# Altium schematic sheet 10_Wifi.SchDoc
size A4
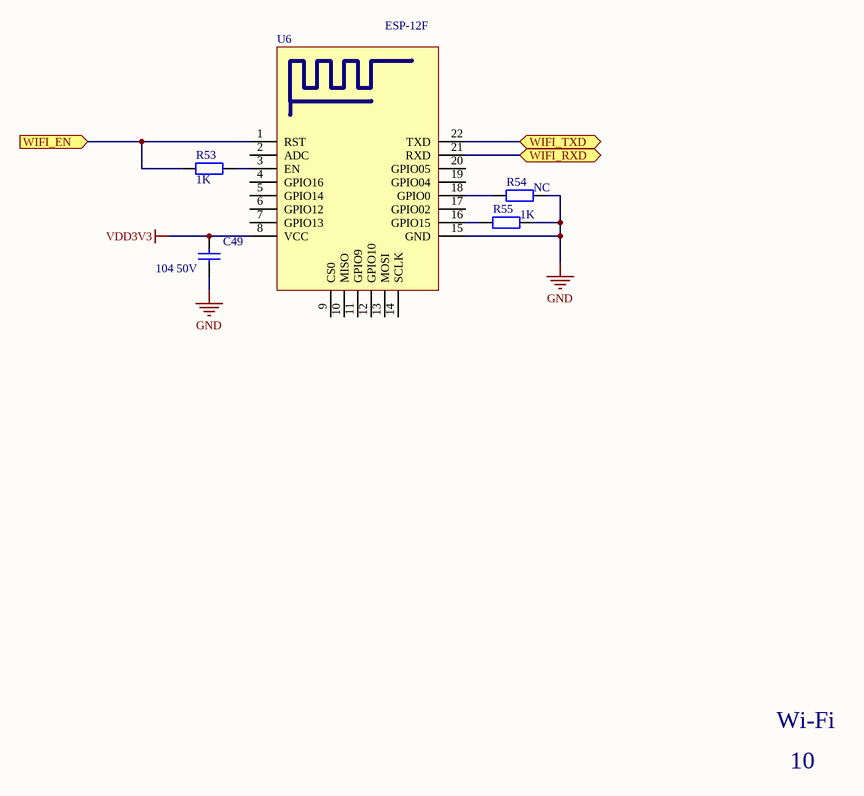
[diagram p0: 10_Wifi.SchDoc]

## Parts
C49  104 50V  [SMD-0603C]
R53  1K  [SMD-0603]
R54  NC  [SMD-0603]
R55  1K  [SMD-0603]
U6  ESP-12F  [ESP-12F]

## Ports
WIFI_EN (in), WIFI_RXD (bidir), WIFI_TXD (bidir)

## Nets
GND: C49.1 R54.1 R55.2 U6.15(GND)
VDD3V3: C49.2 U6.8(VCC)
WIFI_EN: R53.1 U6.1(RST) ; port WIFI_EN
WIFI_RXD: U6.21(RXD) ; port WIFI_RXD
WIFI_TXD: U6.22(TXD) ; port WIFI_TXD
NetR53_2: R53.2 U6.3(EN)
NetR54_2: R54.2 U6.18(GPIO0)
NetR55_1: R55.1 U6.16(GPIO15)

Not connected (* = marked no-connect by the designer): U6 2(ADC) 4(GPIO16) 5(GPIO14) 6(GPIO12) 7(GPIO13) 9(CS0) 10(MISO) 11(GPIO9) 12(GPIO10) 13(MOSI) 14(SCLK) 17(GPIO02) 19(GPIO04) 20(GPIO05)

## Notes on the sheet
- Wi-Fi
- 10

## Library data of the parts
C49 = CAP4: 贴片电容 20%
R53-R55 = RES2: 贴片电阻 5%
U6 = ESP8266